# EAGLE schematic side_wide (EAGLE 9.3.0)
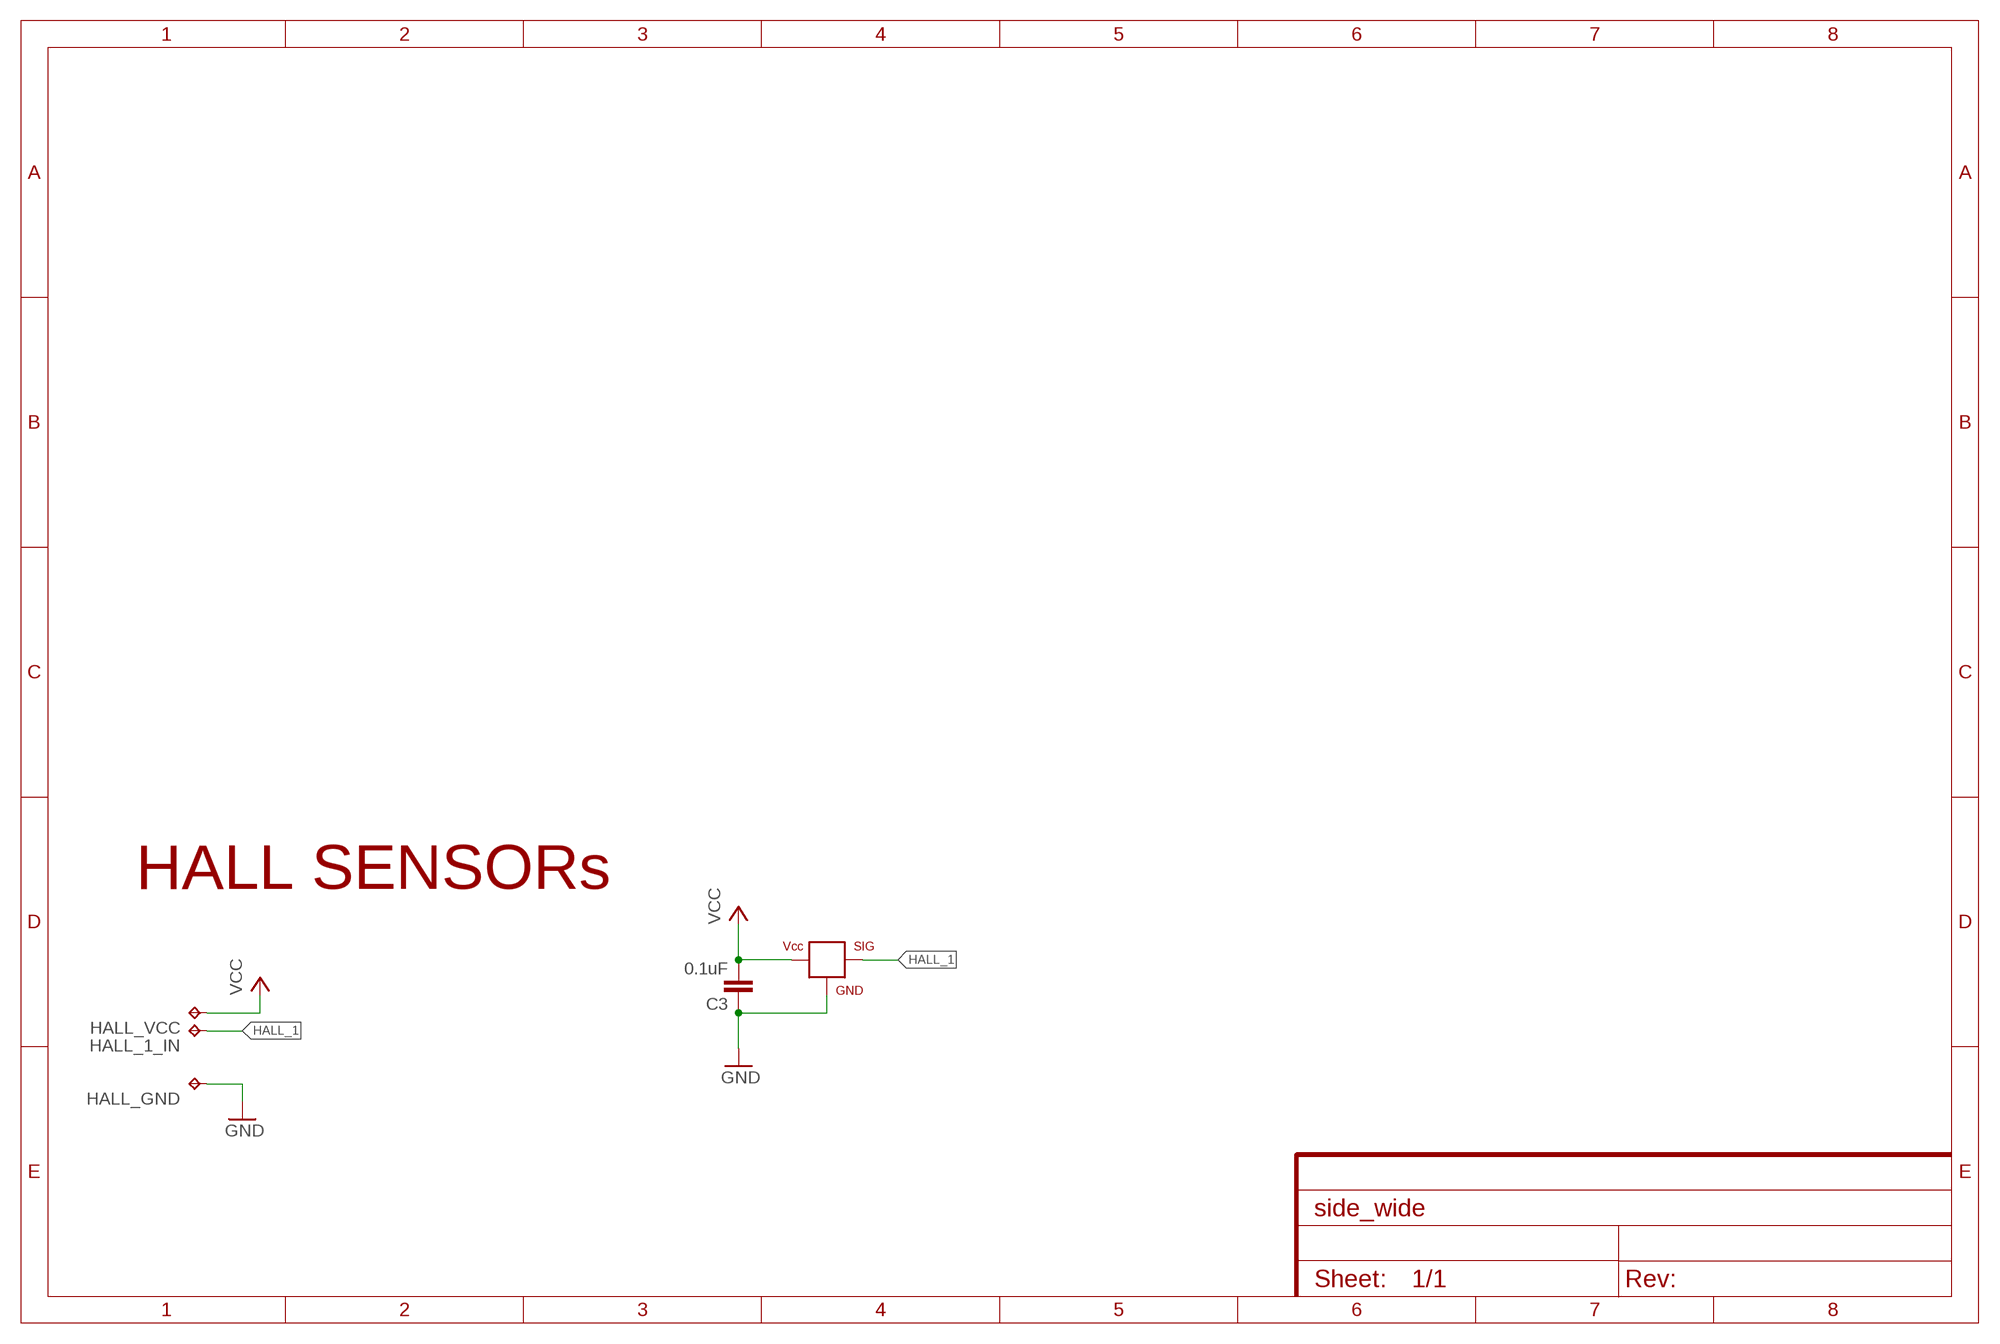
[diagram p0: schematic, sheet 1]

## Parts
C3  0.1uF  CAP0603-CAP  [0603-CAP]
HALL  HALLEFFECT-A1326  [SOT23-3]
HALL_1_IN  TPTP20SQ  [TP20SQ]
HALL_GND  TPTP20SQ  [TP20SQ]
HALL_VCC  TPTP20SQ  [TP20SQ]

## Nets
GND: C3.1 HALL.3(GND) HALL_GND.TP
HALL_1: HALL.2(SIG) HALL_1_IN.TP
VCC: C3.2 HALL.1(VCC) HALL_VCC.TP

## Notes on the sheet
- HALL SENSORs

## Library data of the parts
C3 = SparkFun:CAP: Capacitor Standard 0603 ceramic capacitor, and 0.1" leaded capacitor.
HALL = Andy_Sigler:HALLEFFECT-A1326
HALL_1_IN HALL_GND HALL_VCC = testpad:TP: Test pad